# EasyEDA schematic SCH_TSIB v1_2022-11-26.json

## Sheets
1 UX: TITLE: Sheet_1; REV: 1.0; Date: 2021-12-28; Sheet: 1/1; Drawn By: fmefi; Company: Your Company
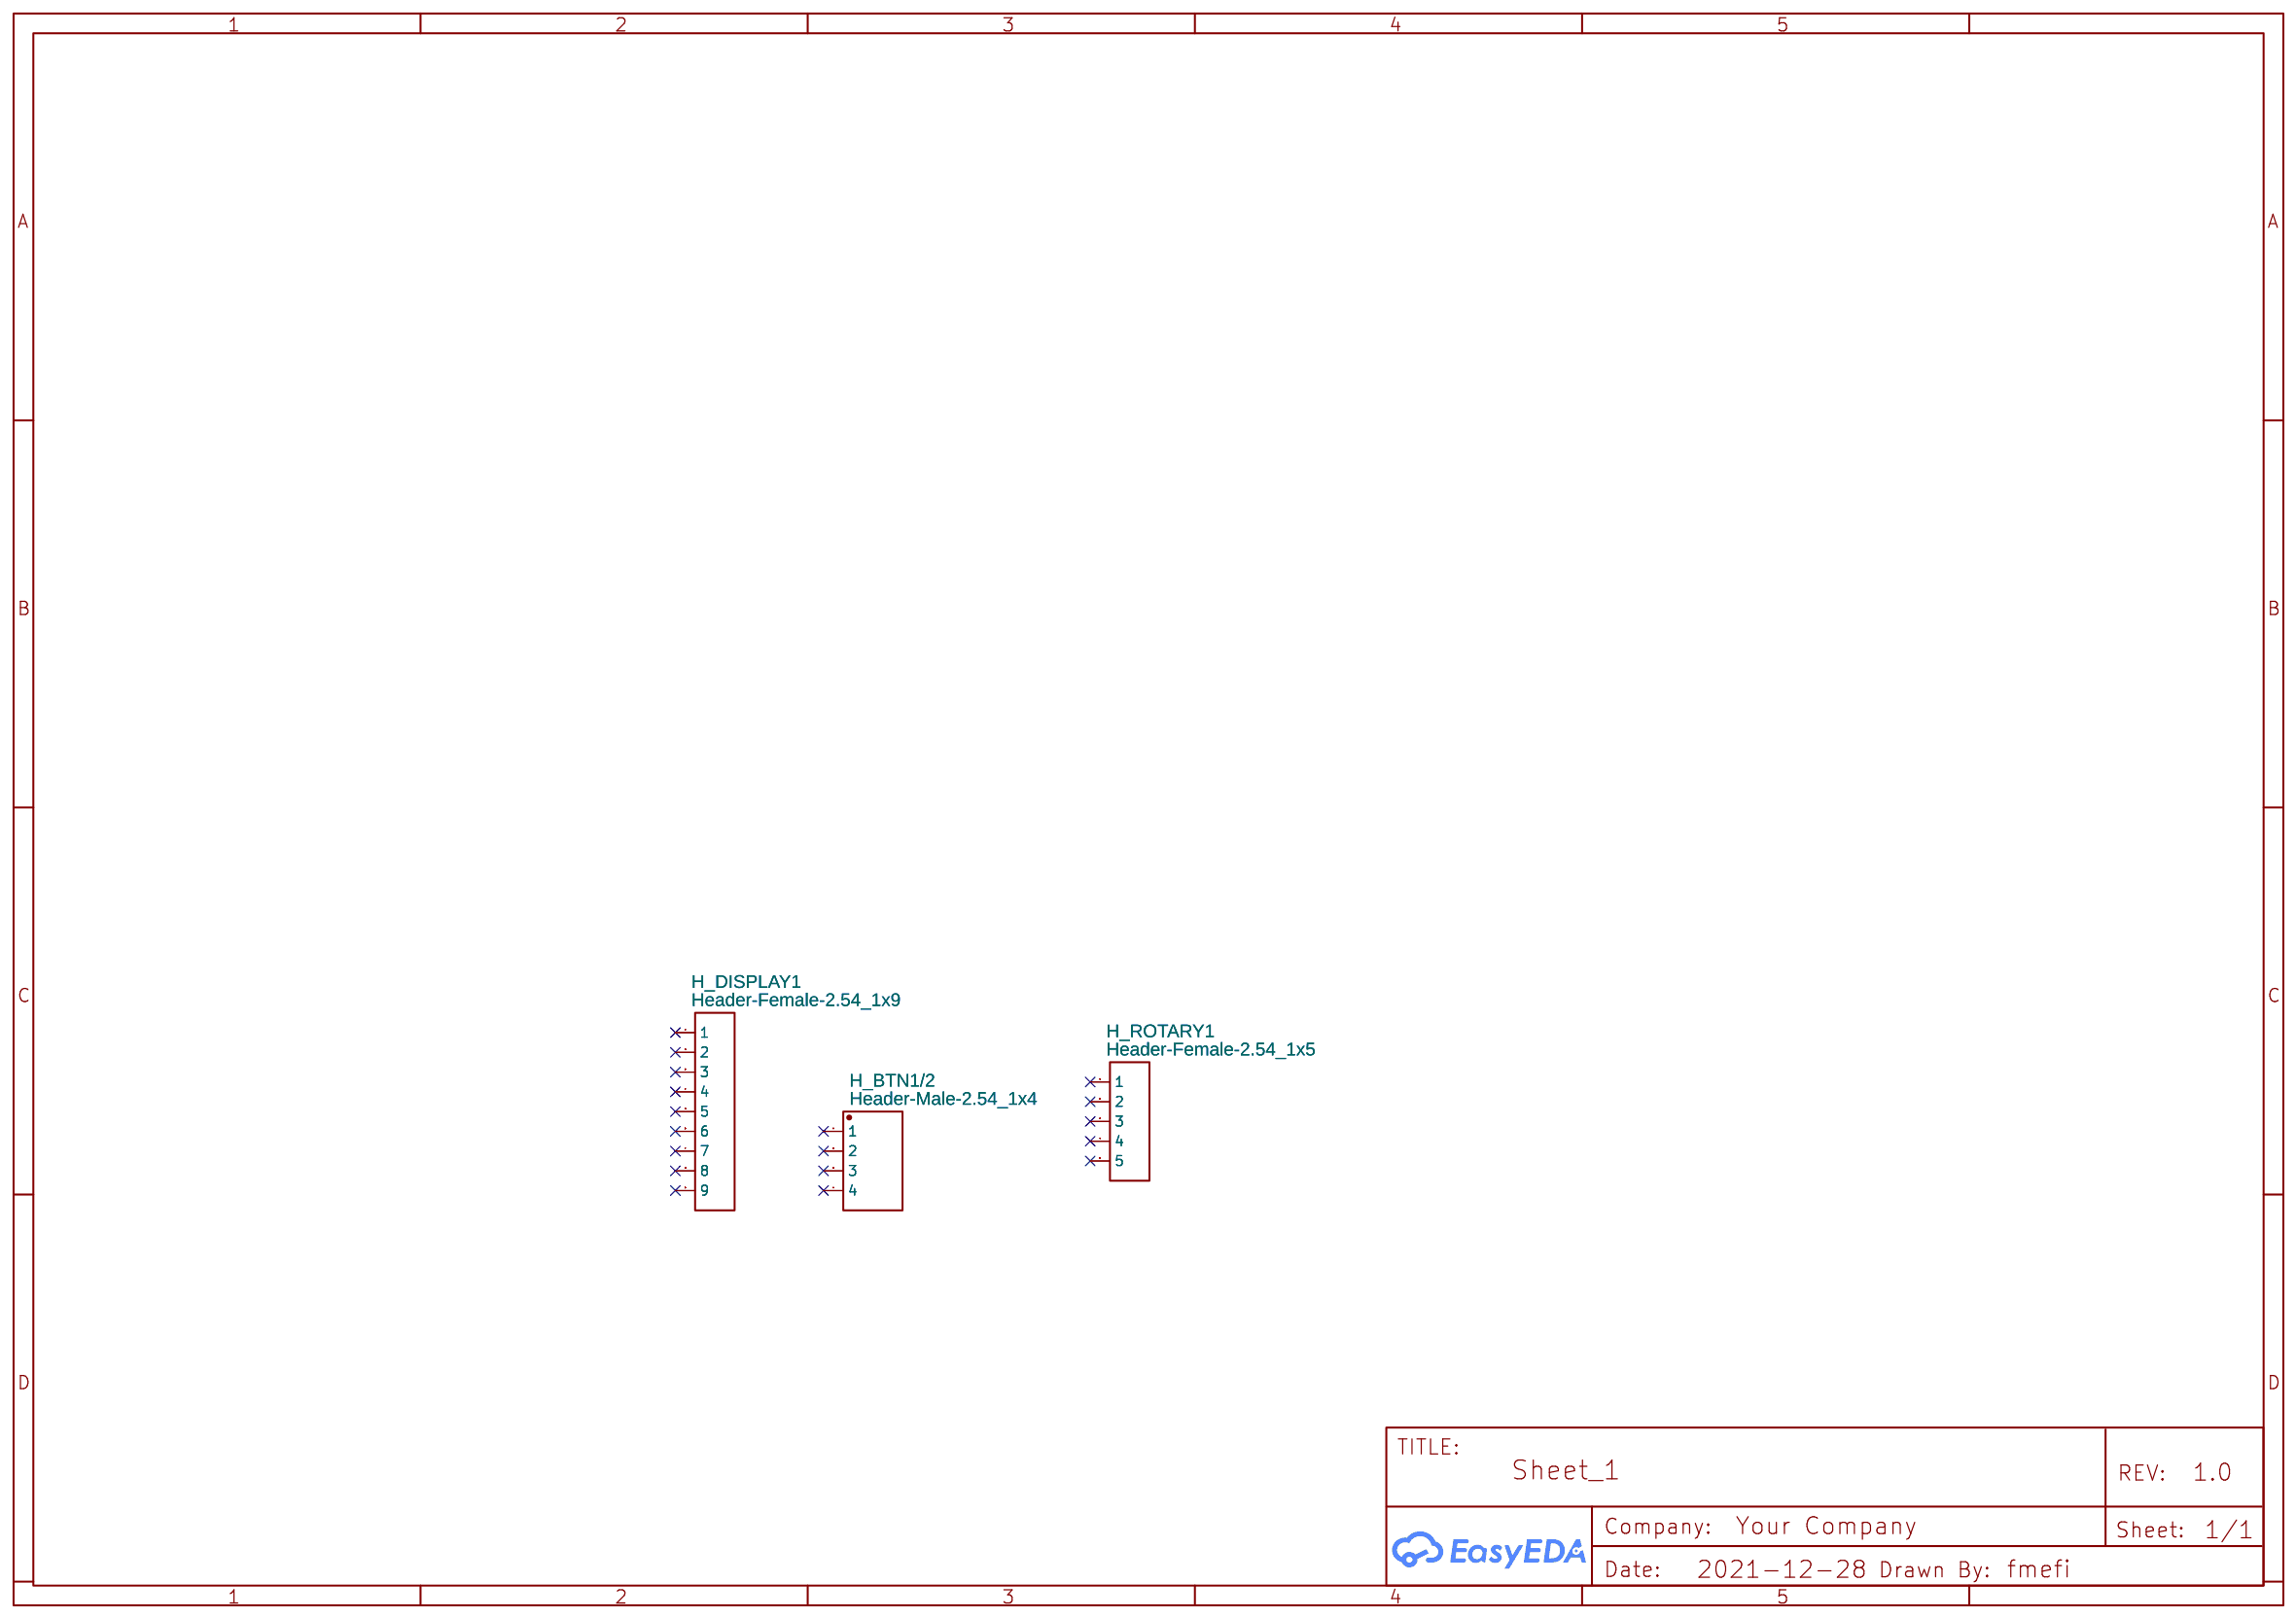
[diagram p0: UX]
2 TSIB_v1.0: TITLE: Sheet_2
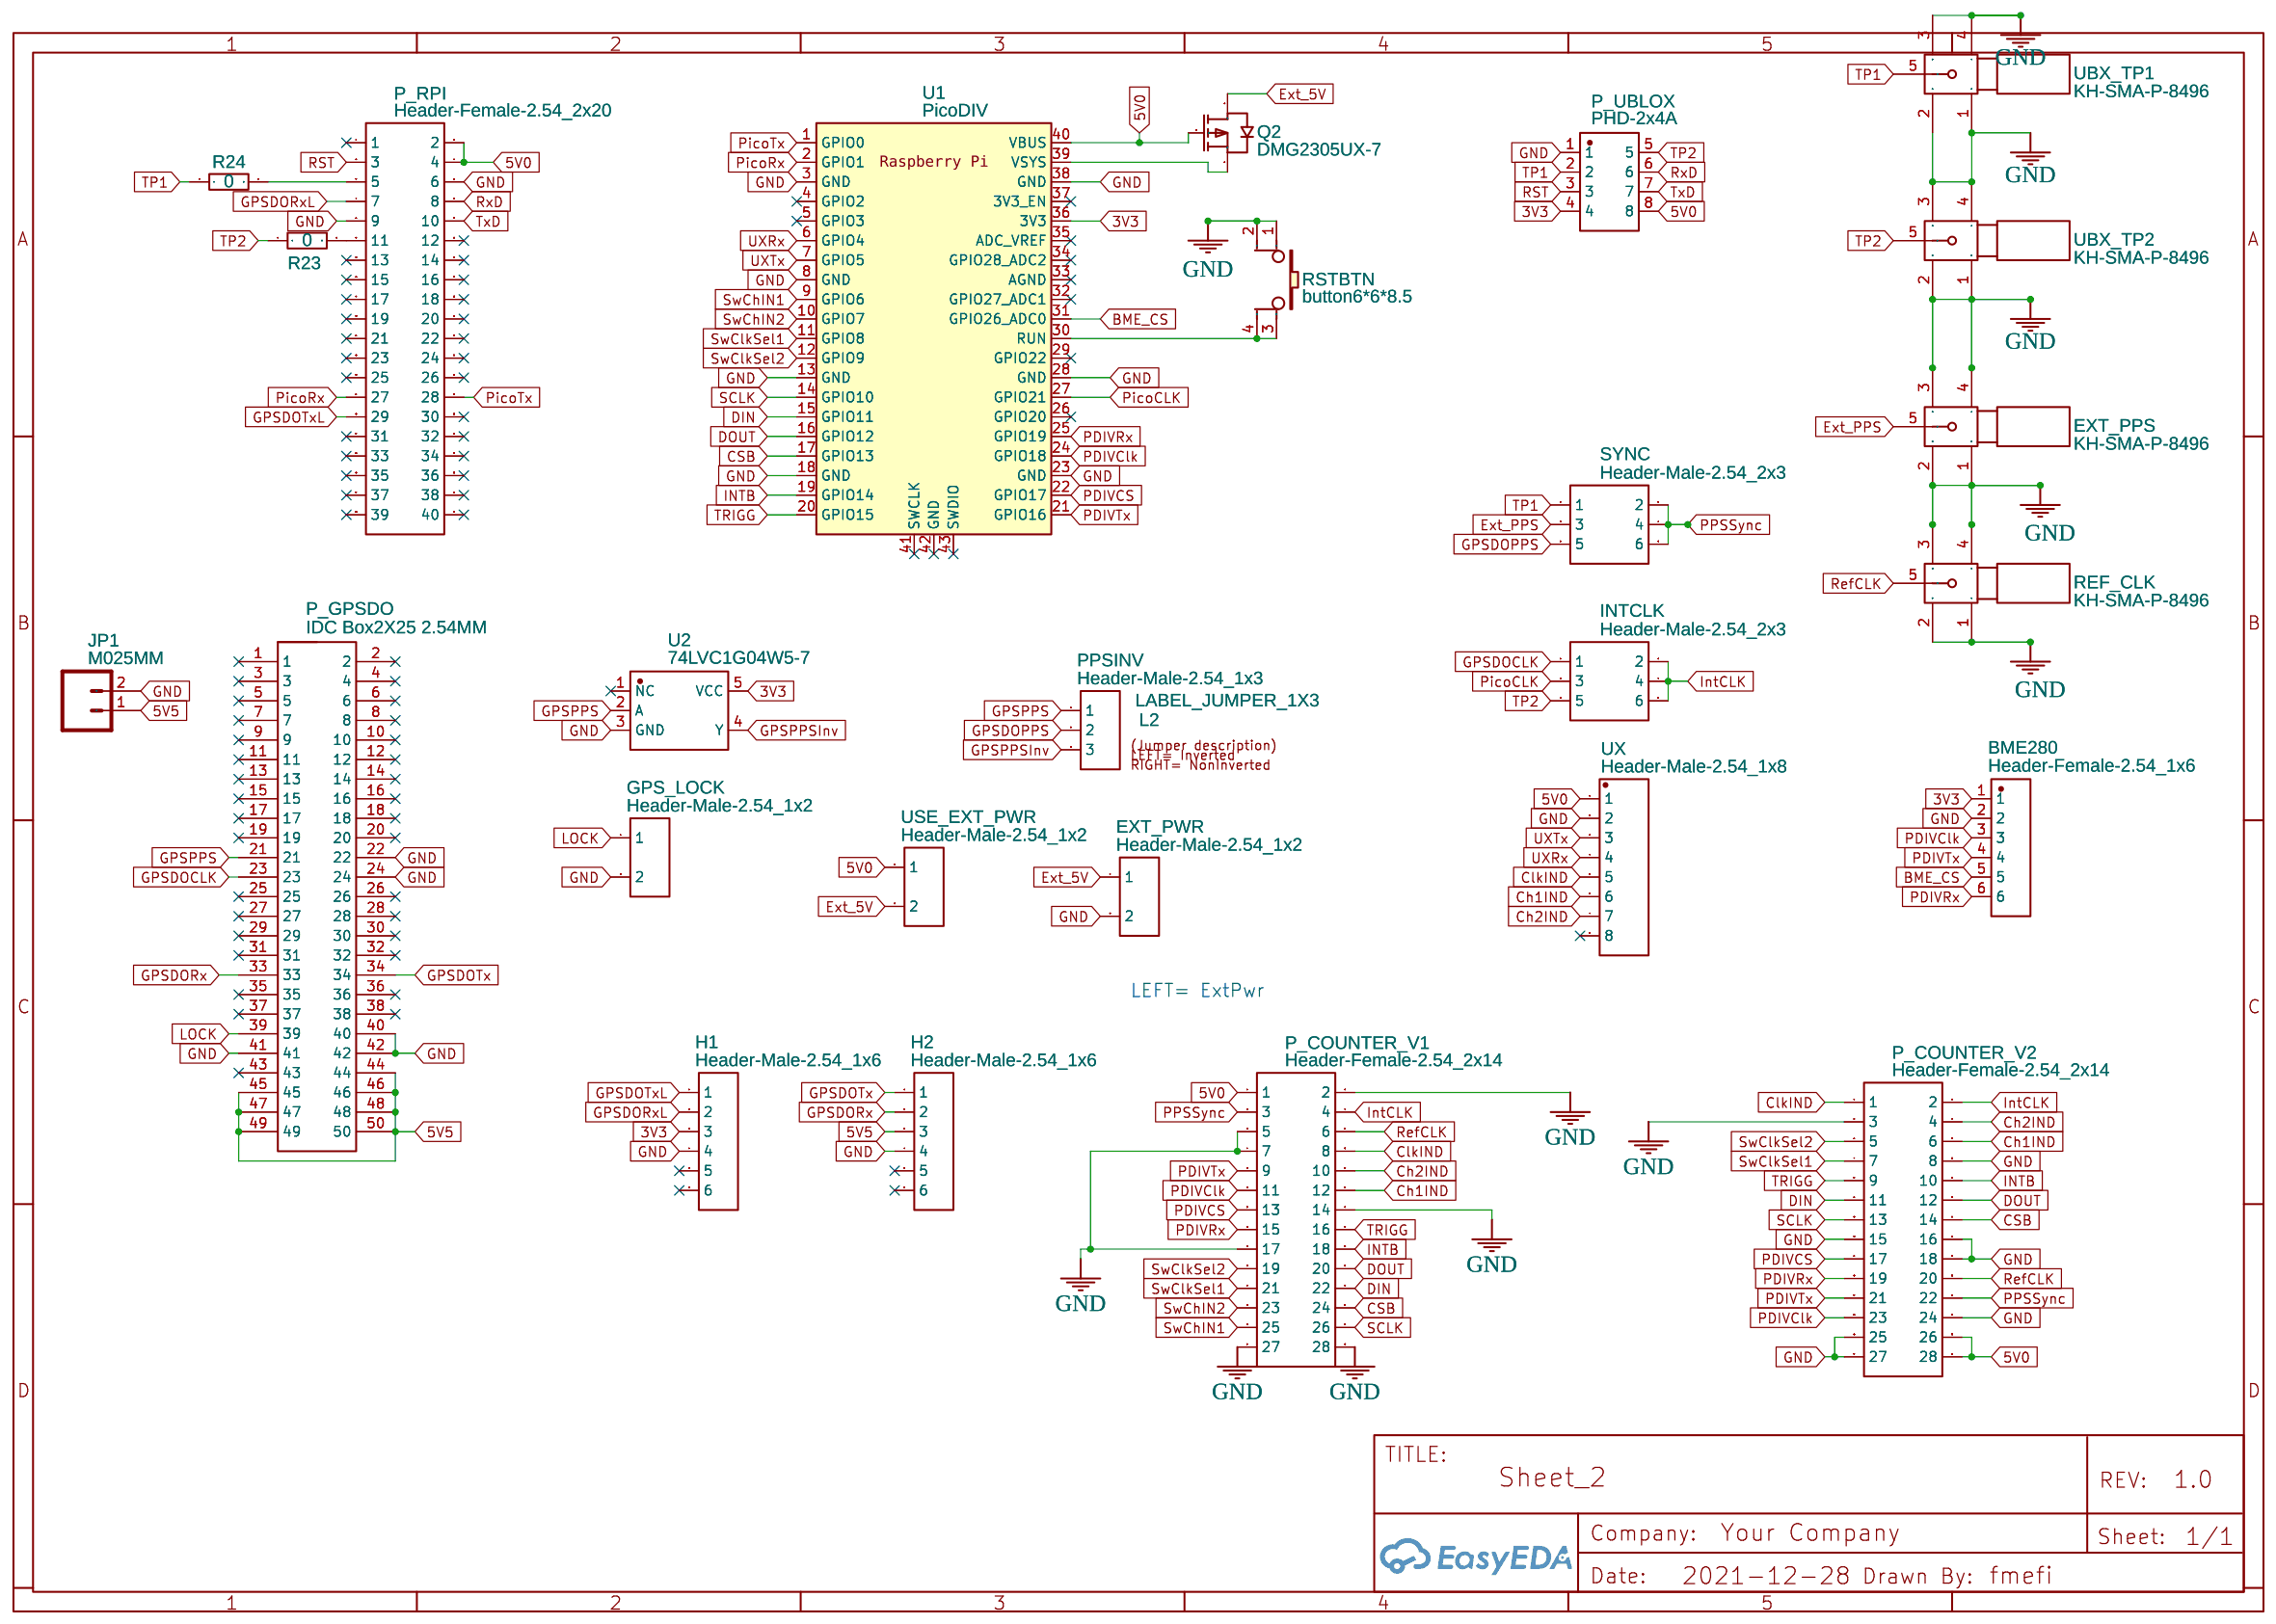
[diagram p1: TSIB_v1.0]

## Parts
sheet TSIB_v1.0
BME280  Header-Female-2.54_1x6  [HDR-TH_6P-P2.54-V-F]
EXT_PPS  KH-SMA-P-8496  [SMA-TH_KH-SMA-P-8496]
EXT_PWR  Header-Male-2.54_1x2  [HDR-TH_2P-P2.54-V-M-1]
GPS_LOCK  Header-Male-2.54_1x2  [HDR-TH_2P-P2.54-V-M-1]
H1  Header-Male-2.54_1x6  [HDR-TH_6P-P2.54-V-M-1]
H2  Header-Male-2.54_1x6  [HDR-TH_6P-P2.54-V-M-1]
INTCLK  Header-Male-2.54_2x3  [HDR-TH_6P-P2.54-V-M-R2-C3-S2.54-1]
JP1  M025MM  [SCREWTERMINAL-5MM-2]
L2  LABEL_JUMPER_1X3  [JUMP3_DESC]
P_COUNTER_V1  Header-Female-2.54_2x14  [HDR-TH_28P-P2.54-V-F-R2-C14-S2.54-1]
P_COUNTER_V2  Header-Female-2.54_2x14  [HDR-TH_28P-P2.54-V-F-R2-C14-S2.54-1]
P_GPSDO  IDC Box2X25 2.54MM  [IDC-TH_50P-P2.54_BOOMELE2X25P]
P_RPI  Header-Female-2.54_2x20  [HDR-TH_40P-P2.54-V-F-R2-C20-S2.54]
P_UBLOX  PHD-2x4A  [CONN-TH_8P-P2.00_PHD-2X4A]
PPSINV  Header-Male-2.54_1x3  [HDR-TH_3P-P2.54-V-M-1]
Q2  DMG2305UX-7  [SOT-23-3_L2.9-W1.3-P1.90-LS2.4-BR]
R23  0  [R0805]
R24  0  [R0805]
REF_CLK  KH-SMA-P-8496  [SMA-TH_KH-SMA-P-8496]
RSTBTN  button6*6*8.5  [KEY-TH_4P-L6.0-W6.0-P4.50]
SYNC  Header-Male-2.54_2x3  [HDR-TH_6P-P2.54-V-M-R2-C3-S2.54-1]
U1  PicoDIV  [RPI_PICO_SMD_TH]
U2  74LVC1G04W5-7  [SOT-25_L3.0-W1.6-P0.95-LS2.8-BL]
UBX_TP1  KH-SMA-P-8496  [SMA-TH_KH-SMA-P-8496]
UBX_TP2  KH-SMA-P-8496  [SMA-TH_KH-SMA-P-8496]
USE_EXT_PWR  Header-Male-2.54_1x2  [HDR-TH_2P-P2.54-V-M-1]
UX  Header-Male-2.54_1x8  [HDR-TH_8P-P2.54-V-M]
sheet UX
H_BTN1/2  Header-Male-2.54_1x4  [HDR-TH_4P-P2.54-V-M]
H_DISPLAY1  Header-Female-2.54_1x9  [HDR-TH_9P-P2.54-V-F-1]
H_ROTARY1  Header-Female-2.54_1x5  [HDR-TH_5P-P2.54-V-F]

## Library data of the parts
BME280 = Header-Female-2.54_1x6: Supplier: LCSC; Manufacturer: BOOMELE; Manufacturer Part: Female header 1*6p; Supplier Part: C40877; JLCPCB Part Class: Extended Part
EXT_PPS REF_CLK UBX_TP1 UBX_TP2 = KH-SMA-P-8496: Supplier: LCSC; Supplier Part: C910123; Manufacturer: Shenzhen Kinghelm Elec; Contributor: LCSC; JLCPCB Part Class: Extended Part
EXT_PWR GPS_LOCK USE_EXT_PWR = Header-Male-2.54_1x2: Supplier: LCSC; Manufacturer: TE Connectivity; Manufacturer Part: 826629-2; Supplier Part: C86471; JLCPCB Part Class: Extended Part
H1 H2 = Header-Male-2.54_1x6: Supplier: LCSC; Manufacturer: BOOMELE; Supplier Part: C37208; JLCPCB Part Class: Extended Part
INTCLK SYNC = Header-Male-2.54_2x3: Supplier: LCSC; Manufacturer: BOOMELE; Supplier Part: C65114; JLCPCB Part Class: Extended Part
JP1 = M025MM: Standard 2-pin 0.1 header. Use with; Contributor: SparkFun
L2 = LABEL_JUMPER_1X3: Nice formatted three legged jumperdescription; Contributor: DangerousPrototype
P_COUNTER_V1 P_COUNTER_V2 = Header-Female-2.54_2x14: Supplier: LCSC; Manufacturer: BOOMELE; Manufacturer Part: 2×14 Double female header; Supplier Part: C60375; JLCPCB Part Class: Extended Part
P_GPSDO = IDC Box2X25 2.54MM: Supplier: LCSC; Manufacturer: BOOMELE; Supplier Part: C30006; JLCPCB Part Class: Extended Part
P_RPI = Header-Female-2.54_2x20: Supplier: LCSC; Manufacturer: BOOMELE; Manufacturer Part: 2.54mm 2*20PFemale header; Supplier Part: C50982; JLCPCB Part Class: Extended Part
P_UBLOX = PHD-2x4A: Supplier: LCSC; Manufacturer: BOOMELE; Manufacturer Part: PHD2.0mm-2*4header; Supplier Part: C20701; JLCPCB Part Class: Extended Part
PPSINV = Header-Male-2.54_1x3: Supplier: LCSC; Manufacturer: BOOMELE; Manufacturer Part: Header2.54mm 1*3P; Supplier Part: C49257; JLCPCB Part Class: Extended Part
Q2 = DMG2305UX-7: Supplier: LCSC; Supplier Part: C150470; Manufacturer: Diodes Incorporated; Contributor: LCSC; JLCPCB Part Class: Extended Part
R23 R24 = 0805W8F0000T5E: Supplier: LCSC; Manufacturer: UniOhm; Supplier Part: C17477; JLCPCB Part Class: Basic Part
RSTBTN = button6*6*8.5: Supplier Part: C59980; Supplier: LCSC; Manufacturer: ReliaPro
U1 = Pico: Contributor: Alexey Gumenchuk
U2 = 74LVC1G04W5-7: Supplier: LCSC; Supplier Part: C460517; Manufacturer: Diodes Incorporated; Contributor: LCSC
UX = Header-Male-2.54_1x8: Supplier: LCSC; Manufacturer: Ckmtw; Manufacturer Part: 210S-1*8P L=11.6MMGold-plated black; Contributor: LCSC; Supplier Part: C124381; JLCPCB Part Class: Extended Part
H_BTN1/2 = Header-Male-2.54_1x4: Supplier: LCSC; Manufacturer: Ckmtw; Manufacturer Part: 210S-1*4P L=11.6MMGold-plated black; Contributor: LCSC; Supplier Part: C124378; JLCPCB Part Class: Extended Part
H_DISPLAY1 = Header-Female-2.54_1x9: Supplier: LCSC; Manufacturer: BOOMELE; Manufacturer Part: 2.54mm 1*9 Straight Female header; Supplier Part: C39576; JLCPCB Part Class: Extended Part
H_ROTARY1 = Header-Female-2.54_1x5: Supplier: LCSC; Manufacturer: BOOMELE; Manufacturer Part: 2.54mm 1*5p Female header; Supplier Part: C50950; JLCPCB Part Class: Extended Part

## Nets
3V3: BME280.1 H1.3 P_UBLOX.4 U1.36(3V3) U2.5(VCC)
5V0: P_COUNTER_V1.1 P_COUNTER_V2.26 P_COUNTER_V2.28 P_RPI.2 P_RPI.4 P_UBLOX.8 Q2.1(G) U1.40(VBUS) USE_EXT_PWR.1 UX.1
5V5: H2.3 JP1.1 P_GPSDO.44 P_GPSDO.45 P_GPSDO.46 P_GPSDO.47 P_GPSDO.48 P_GPSDO.49 P_GPSDO.50
GND: BME280.2 EXT_PPS.1 EXT_PPS.2 EXT_PPS.3 EXT_PPS.4 EXT_PWR.2 GPS_LOCK.2 H1.4 H2.4 JP1.2 P_COUNTER_V1.2 P_COUNTER_V1.5 P_COUNTER_V1.7 P_COUNTER_V1.14 P_COUNTER_V1.17 P_COUNTER_V1.27 P_COUNTER_V1.28 P_COUNTER_V2.3 P_COUNTER_V2.8 P_COUNTER_V2.15 P_COUNTER_V2.16 P_COUNTER_V2.18 P_COUNTER_V2.24 P_COUNTER_V2.25 P_COUNTER_V2.27 P_GPSDO.22 P_GPSDO.24 P_GPSDO.40 P_GPSDO.41 P_GPSDO.42 P_RPI.6 P_RPI.9 P_UBLOX.1 REF_CLK.1 REF_CLK.2 REF_CLK.3 REF_CLK.4 RSTBTN.1 RSTBTN.2 U1.3(GND) U1.8(GND) U1.13(GND) U1.18(GND) U1.23(GND) U1.28(GND) U1.38(GND) U2.3(GND) UBX_TP1.1 UBX_TP1.2 UBX_TP1.3 UBX_TP1.4 UBX_TP2.1 UBX_TP2.2 UBX_TP2.3 UBX_TP2.4 UX.2
BME_CS: BME280.5 U1.31(GPIO26_ADC0)
Ch1IND: P_COUNTER_V1.12 P_COUNTER_V2.6 UX.6
Ch2IND: P_COUNTER_V1.10 P_COUNTER_V2.4 UX.7
ClkIND: P_COUNTER_V1.8 P_COUNTER_V2.1 UX.5
CSB: P_COUNTER_V1.24 P_COUNTER_V2.14 U1.17(GPIO13)
DIN: P_COUNTER_V1.22 P_COUNTER_V2.11 U1.15(GPIO11)
DOUT: P_COUNTER_V1.20 P_COUNTER_V2.12 U1.16(GPIO12)
Ext_5V: EXT_PWR.1 Q2.3(D) USE_EXT_PWR.2
Ext_PPS: EXT_PPS.5 SYNC.3
GPSDOCLK: INTCLK.1 P_GPSDO.23
GPSDOPPS: PPSINV.2 SYNC.5
GPSDORx: H2.2 P_GPSDO.33
GPSDORxL: H1.2 P_RPI.7
GPSDOTx: H2.1 P_GPSDO.34
GPSDOTxL: H1.1 P_RPI.29
GPSPPS: P_GPSDO.21 PPSINV.1 U2.2(A)
GPSPPSInv: PPSINV.3 U2.4(Y)
INTB: P_COUNTER_V1.18 P_COUNTER_V2.10 U1.19(GPIO14)
IntCLK: INTCLK.2 INTCLK.4 INTCLK.6 P_COUNTER_V1.4 P_COUNTER_V2.2
LOCK: GPS_LOCK.1 P_GPSDO.39
PDIVClk: BME280.3 P_COUNTER_V1.11 P_COUNTER_V2.23 U1.24(GPIO18)
PDIVCS: P_COUNTER_V1.13 P_COUNTER_V2.17 U1.22(GPIO17)
PDIVRx: BME280.6 P_COUNTER_V1.15 P_COUNTER_V2.19 U1.25(GPIO19)
PDIVTx: BME280.4 P_COUNTER_V1.9 P_COUNTER_V2.21 U1.21(GPIO16)
PicoCLK: INTCLK.3 U1.27(GPIO21)
PicoRx: P_RPI.27 U1.2(GPIO1)
PicoTx: P_RPI.28 U1.1(GPIO0)
PPSSync: P_COUNTER_V1.3 P_COUNTER_V2.22 SYNC.2 SYNC.4 SYNC.6
RefCLK: P_COUNTER_V1.6 P_COUNTER_V2.20 REF_CLK.5
RST: P_RPI.3 P_UBLOX.3
RxD: P_RPI.8 P_UBLOX.6
SCLK: P_COUNTER_V1.26 P_COUNTER_V2.13 U1.14(GPIO10)
SwChIN1: P_COUNTER_V1.25 U1.9(GPIO6)
SwChIN2: P_COUNTER_V1.23 U1.10(GPIO7)
SwClkSel1: P_COUNTER_V1.21 P_COUNTER_V2.7 U1.11(GPIO8)
SwClkSel2: P_COUNTER_V1.19 P_COUNTER_V2.5 U1.12(GPIO9)
TP1: P_UBLOX.2 R24.1 SYNC.1 UBX_TP1.5
TP2: INTCLK.5 P_UBLOX.5 R23.1 UBX_TP2.5
TRIGG: P_COUNTER_V1.16 P_COUNTER_V2.9 U1.20(GPIO15)
TxD: P_RPI.10 P_UBLOX.7
UXRx: U1.6(GPIO4) UX.4
UXTx: U1.7(GPIO5) UX.3
Net-(P_RPI-5): P_RPI.5 R24.2
Net-(P_RPI-11): P_RPI.11 R23.2
Net-(Q2-2): Q2.2(S) U1.39(VSYS)
Net-(RSTBTN-3): RSTBTN.3 RSTBTN.4 U1.30(RUN)

Not connected (* = marked no-connect by the designer): H1 5* 6*; H2 5* 6*; H_BTN1/2 1* 2* 3* 4*; H_DISPLAY1 1* 2* 3* 4* 5* 6* 7* 8* 9*; H_ROTARY1 1* 2* 3* 4* 5*; P_GPSDO 1* 2* 3* 4* 5* 6* 7* 8* 9* 10* 11* 12* 13* 14* 15* 16* 17* 18* 19* 20* 25* 26* 27* 28* 29* 30* 31* 32* 35* 36* 37* 38* 43*; P_RPI 1* 12* 13* 14* 15* 16* 17* 18* 19* 20* 21* 22* 23* 24* 25* 26* 30* 31* 32* 33* 34* 35* 36* 37* 38* 39* 40*; U1 4(GPIO2)* 5(GPIO3)* 26(GPIO20)* 29(GPIO22)* 32(GPIO27_ADC1)* 33(AGND)* 34(GPIO28_ADC2)* 35(ADC_VREF)* 37(3V3_EN)* 41(SWCLK)* 42(GND)* 43(SWDIO)*; U2 1(NC)*; UX 8*

## Notes on the sheets
sheet 2
- LEFT= ExtPwr
